# Altium schematic sheet LEDS_SENSOR_ZS.SchDoc: ZSU - LEDs/Sensor
size B; DrawnBy: M. Seago; Organization: Gravitas; Address1: Sponsored By:; Address2: Alan Morgan; Address3: Technical Advisor:; Address4: Dr. Joseph Morgan; Revision: 1A; SheetNumber: 2; SheetTotal: 3
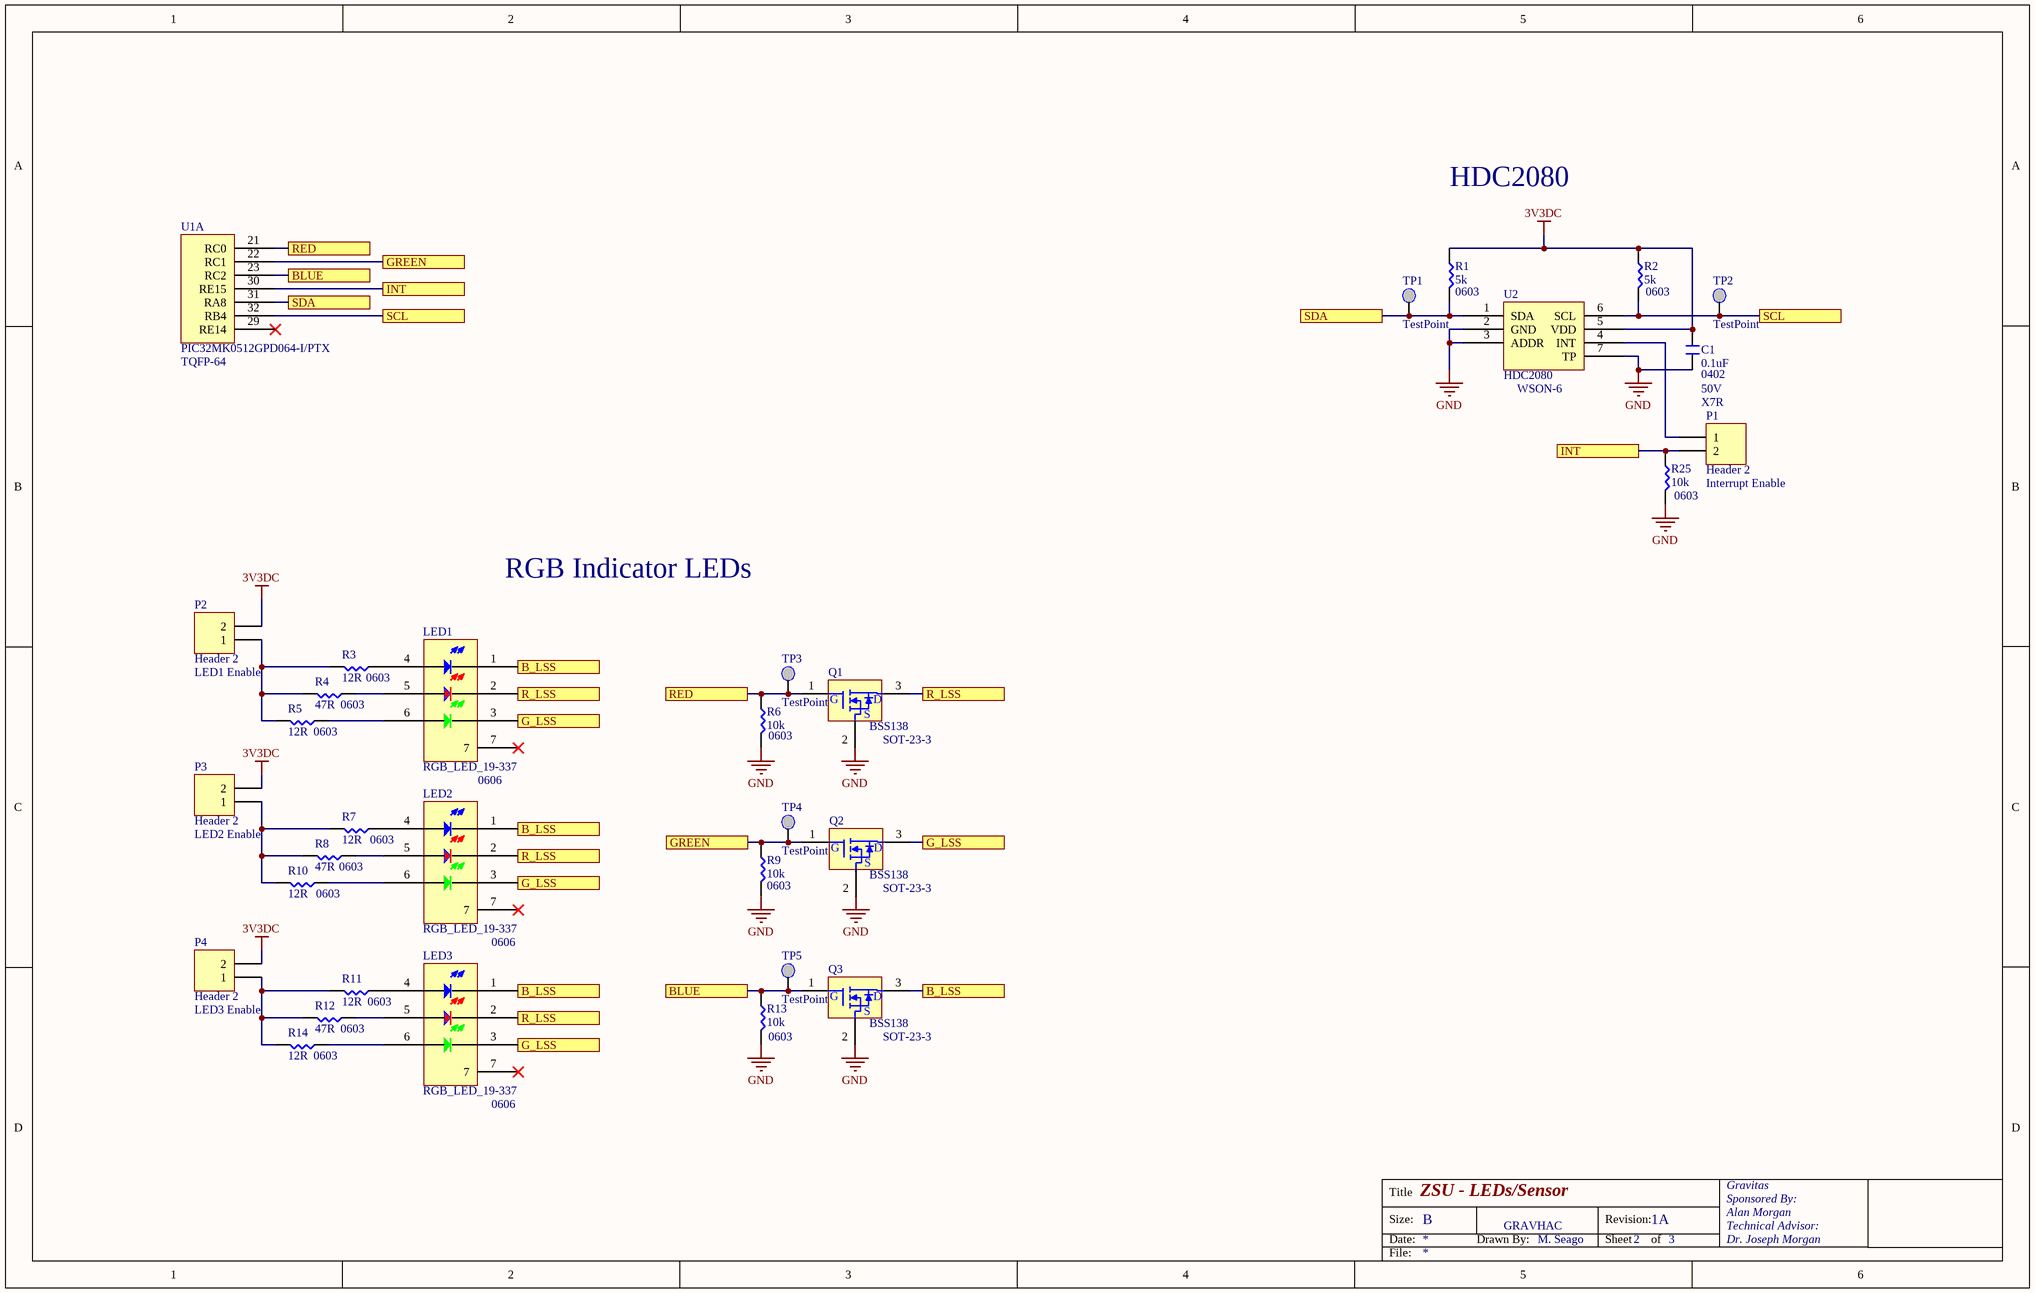
[diagram p0: LEDS_SENSOR_ZS.SchDoc]

## Parts
C1  0.1uF  [NonPolar-0402]
LED1  RGB_LED_19-337  [RGB_LED_19-337]
LED2  RGB_LED_19-337  [RGB_LED_19-337]
LED3  RGB_LED_19-337  [RGB_LED_19-337]
P1  Header 2  [HDR1X2]
P2  Header 2  [HDR1X2]
P3  Header 2  [HDR1X2]
P4  Header 2  [HDR1X2]
Q1  BSS138  [BSS138-SOT23]
Q2  BSS138  [BSS138-SOT23]
Q3  BSS138  [BSS138-SOT23]
R1  5k  [NonPolar-0603]
R2  5k  [NonPolar-0603]
R3  12R  [NonPolar-0603]
R4  47R  [NonPolar-0603]
R5  12R  [NonPolar-0603]
R6  10k  [NonPolar-0603]
R7  12R  [NonPolar-0603]
R8  47R  [NonPolar-0603]
R9  10k  [NonPolar-0603]
R10  12R  [NonPolar-0603]
R11  12R  [NonPolar-0603]
R12  47R  [NonPolar-0603]
R13  10k  [NonPolar-0603]
R14  12R  [NonPolar-0603]
R25  10k  [NonPolar-0603]
TP1  TestPoint  [TP - S2751-46R]
TP2  TestPoint  [TP - S2751-46R]
TP3  TestPoint  [TP - S2751-46R]
TP4  TestPoint  [TP - S2751-46R]
TP5  TestPoint  [TP - S2751-46R]
U1  PIC32MK0512GPD064-I/PTX  [PIC32MK0512GPD064]  (part A of 3)
U2  HDC2080  [HDC2080]

## Ports
B_LSS, BLUE, G_LSS, GREEN, INT, R_LSS, RED, SCL, SDA

## Nets
3V3DC: C1.2 P2.2 P3.2 P4.2 R1.2 R2.2 U2.5(VDD)
GND: C1.1 Q1.2(S) Q2.2(S) Q3.2(S) R6.1 R9.1 R13.1 R25.1 U2.2(GND) U2.3(ADDR) U2.7(TP)
B_LSS: LED1.1 LED2.1 LED3.1 Q3.3(D) ; port B_LSS
BLUE: Q3.1(G) R13.2 TP5.1 U1.23(RC2) ; port BLUE
G_LSS: LED1.3 LED2.3 LED3.3 Q2.3(D) ; port G_LSS
GREEN: Q2.1(G) R9.2 TP4.1 U1.22(RC1) ; port GREEN
INT: P1.2 R25.2 U1.30(RE15) ; port INT
R_LSS: LED1.2 LED2.2 LED3.2 Q1.3(D) ; port R_LSS
RED: Q1.1(G) R6.2 TP3.1 U1.21(RC0) ; port RED
SCL: R2.1 TP2.1 U1.32(RB4) U2.6(SCL) ; port SCL
SDA: R1.1 TP1.1 U1.31(RA8) U2.1(SDA) ; port SDA
NetLED1_4: LED1.4 R3.2
NetLED1_5: LED1.5 R4.2
NetLED1_6: LED1.6 R5.2
NetLED2_4: LED2.4 R7.2
NetLED2_5: LED2.5 R8.2
NetLED2_6: LED2.6 R10.2
NetLED3_4: LED3.4 R11.2
NetLED3_5: LED3.5 R12.2
NetLED3_6: LED3.6 R14.2
NetP1_1: P1.1 U2.4(INT)
NetP2_1: P2.1 R3.1 R4.1 R5.1
NetP3_1: P3.1 R7.1 R8.1 R10.1
NetP4_1: P4.1 R11.1 R12.1 R14.1

Not connected (* = marked no-connect by the designer): LED1 7*; LED2 7*; LED3 7*; U1 29(RE14)*

## Notes on the sheet
- HDC2080
- (near R1) 0603
- (near R2) 0603
- (near U1) TQFP-64
- (near U2) WSON-6
- (near C1) 0402
- 50V
- X7R
- (near R25) 0603
- Interrupt Enable
- RGB Indicator LEDs
- (near P2) LED1 Enable
- (near R4) 0603
- (near R3) 0603
- (near R5) 0603
- (near R6) 0603
- (near Q1) SOT-23-3
- (near P3) LED2 Enable
- (near R7) 0603
- 0606
- (near R10) 0603
- (near R8) 0603
- (near R9) 0603
- (near Q2) SOT-23-3
- LED3 Enable
- (near R12) 0603
- (near R11) 0603
- (near R13) 0603
- (near Q3) SOT-23-3
- (near R14) 0603
- (near LED3) 0606
- GRAVHAC
- Title
- Size:
- Date:
- B
- Drawn By:
- Revision:
- Sheet
- of
- File:

## Library data of the parts
C1 = Cap - 0402
P1-P4 = Header 2: Header, 2-Pin; LatestRevisionDate: 17-Jul-2002; LatestRevisionNote: Re-released for DXP Platform.; Publisher: Altium Limited
R1-R14 R25 = Res - 0603
TP1-TP5 = TestPoint: S2751-46R